# Altium schematic sheet 01_MainSheet.SchDoc
size A4; Organization: OLTEST; Revision: 01; SheetNumber: 1; SheetTotal: 13; Название листа: Название листа; Разработчик: Бондарчук С.; Прибор: R100; АМАК.000000.000 Э3: R100.230.030.000-00; Дата: 16.04.2019; Формат: A4; WorkspaceName: R100_Board_v1; PageSetup: Record=PageOptions|CenterHorizontal=True|CenterVertical=True|PrintScale=0.97|XCorrection=1.00|YCorrection=1.00|PrintKind=0|BorderSize=5000000|LeftOffset=0|BottomOffset=0|Orientation=2|PaperLength=1000|PaperWidth=1000|Scale=100|PaperSource=7|PrintQuality=-3|MediaType=1|DitherType=10|PrintScaleMode=1|PaperKind=A4|PaperIndex=9
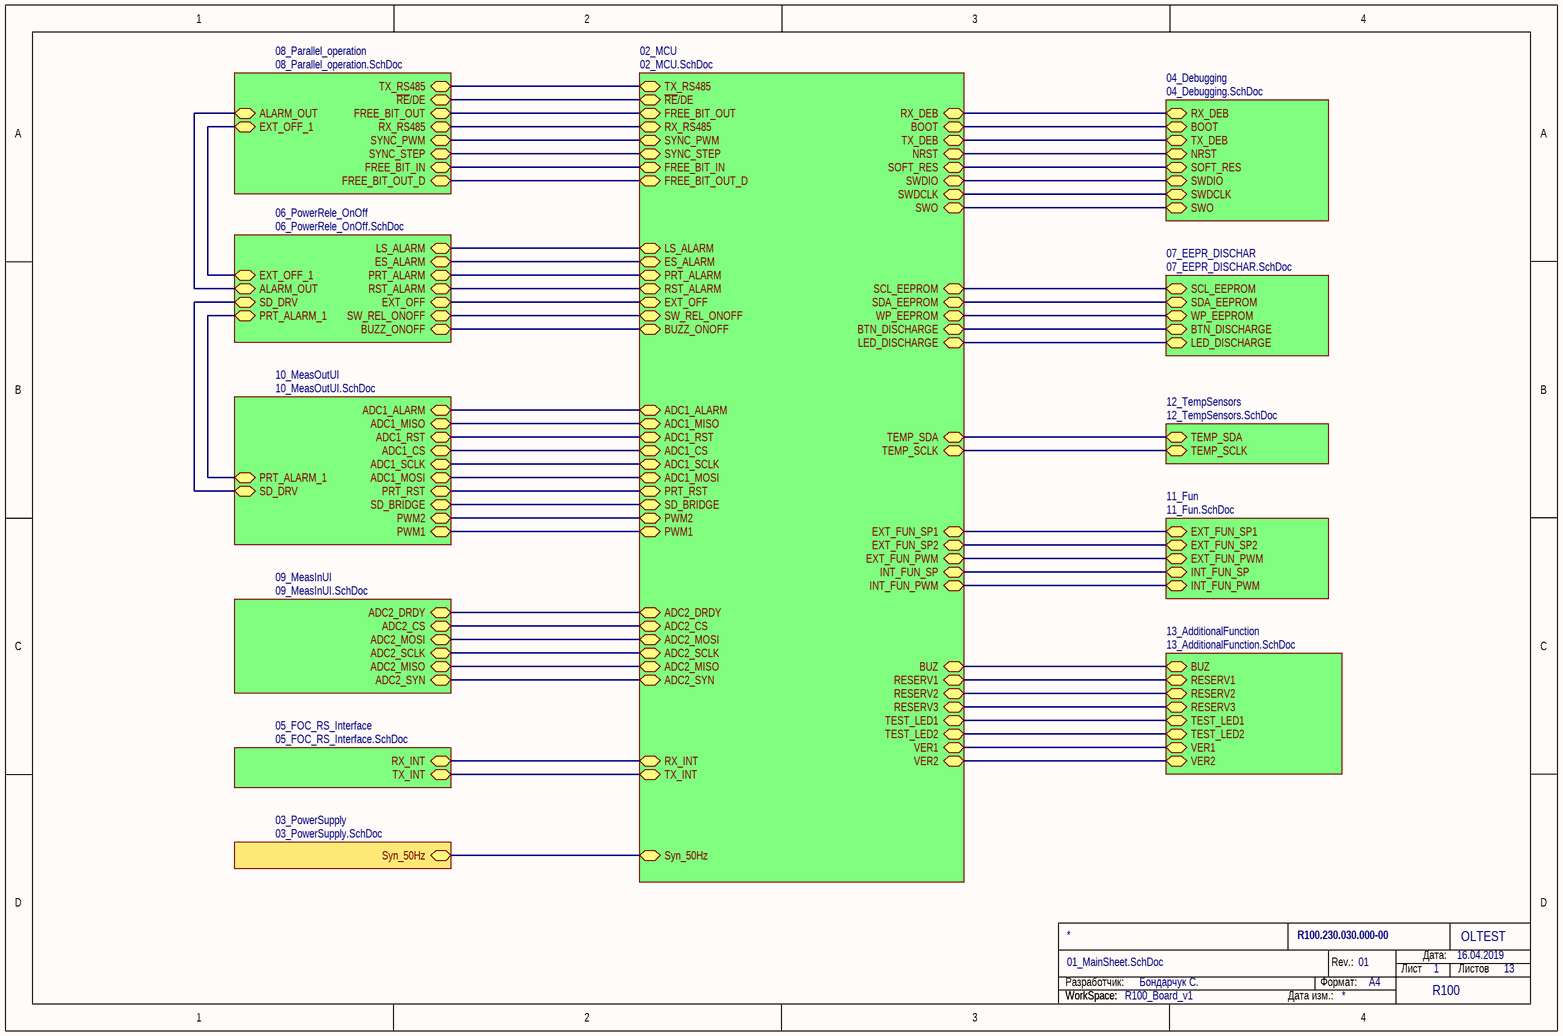
[diagram p0: 01_MainSheet.SchDoc]

## Sub-sheets
02_MCU = 02_MCU.SchDoc: SWO, SOFT_RES, TX_INT, PRT_ALARM, WP_EEPROM, SWDCLK, TX_RS485, LS_ALARM, SCL_EEPROM, SW_REL_ONOFF, ES_ALARM, NRST, RST_ALARM, RX_INT, RX_DEB, Syn_50Hz, BOOT, SDA_EEPROM, SWDIO, TX_DEB, SYNC_PWM, INT_FUN_SP, ADC1_MISO, TEMP_SDA, VER2, LED_DISCHARGE, RX_RS485, ADC1_MOSI, ADC2_MOSI, EXT_FUN_SP2, ADC1_ALARM, FREE_BIT_IN, VER1, ADC2_CS, TEST_LED2, BUZ, ADC1_RST, ADC2_SYN, SD_BRIDGE, ADC1_SCLK, TEST_LED1, PWM1, BUZZ_ONOFF, ADC2_SCLK, EXT_FUN_SP1, ADC1_CS, BTN_DISCHARGE, RESERV2, EXT_OFF, PWM2, ADC2_MISO, RESERV1, EXT_FUN_PWM, TEMP_SCLK, PRT_RST, RESERV3, FREE_BIT_OUT, ~{RE}/DE, INT_FUN_PWM, ADC2_DRDY, SYNC_STEP, FREE_BIT_OUT_D
03_PowerSupply = 03_PowerSupply.SchDoc: Syn_50Hz
04_Debugging = 04_Debugging.SchDoc: SWDIO, TX_DEB, RX_DEB, SWO, SWDCLK, BOOT, SOFT_RES, NRST
05_FOC_RS_Interface = 05_FOC_RS_Interface.SchDoc: RX_INT, TX_INT
06_PowerRele_OnOff = 06_PowerRele_OnOff.SchDoc: PRT_ALARM_1, LS_ALARM, ES_ALARM, PRT_ALARM, RST_ALARM, SW_REL_ONOFF, ALARM_OUT, BUZZ_ONOFF, EXT_OFF, SD_DRV, EXT_OFF_1
07_EEPR_DISCHAR = 07_EEPR_DISCHAR.SchDoc: SCL_EEPROM, SDA_EEPROM, WP_EEPROM, BTN_DISCHARGE, LED_DISCHARGE
08_Parallel_operation = 08_Parallel_operation.SchDoc: ~{RE}/DE, FREE_BIT_OUT, TX_RS485, ALARM_OUT, RX_RS485, SYNC_PWM, SYNC_STEP, FREE_BIT_IN, EXT_OFF_1, FREE_BIT_OUT_D
09_MeasInUI = 09_MeasInUI.SchDoc: ADC2_CS, ADC2_MOSI, ADC2_DRDY, ADC2_SCLK, ADC2_MISO, ADC2_SYN
10_MeasOutUI = 10_MeasOutUI.SchDoc: SD_BRIDGE, ADC1_RST, ADC1_ALARM, PRT_RST, ADC1_MISO, PRT_ALARM_1, ADC1_SCLK, ADC1_CS, ADC1_MOSI, PWM2, PWM1, SD_DRV
11_Fun = 11_Fun.SchDoc: EXT_FUN_PWM, EXT_FUN_SP1, EXT_FUN_SP2, INT_FUN_SP, INT_FUN_PWM
12_TempSensors = 12_TempSensors.SchDoc: TEMP_SCLK, TEMP_SDA
13_AdditionalFunction = 13_AdditionalFunction.SchDoc: RESERV3, RESERV2, VER2, BUZ, RESERV1, VER1, TEST_LED1, TEST_LED2

## Nets
(unnamed): sheet 02_MCU/SWO, sheet 04_Debugging/SWO
(unnamed): sheet 02_MCU/SOFT_RES, sheet 04_Debugging/SOFT_RES
(unnamed): sheet 02_MCU/TX_INT, sheet 05_FOC_RS_Interface/TX_INT
(unnamed): sheet 02_MCU/PRT_ALARM, sheet 06_PowerRele_OnOff/PRT_ALARM
(unnamed): sheet 02_MCU/WP_EEPROM, sheet 07_EEPR_DISCHAR/WP_EEPROM
(unnamed): sheet 02_MCU/SWDCLK, sheet 04_Debugging/SWDCLK
(unnamed): sheet 02_MCU/TX_RS485, sheet 08_Parallel_operation/TX_RS485
(unnamed): sheet 02_MCU/LS_ALARM, sheet 06_PowerRele_OnOff/LS_ALARM
(unnamed): sheet 02_MCU/SCL_EEPROM, sheet 07_EEPR_DISCHAR/SCL_EEPROM
(unnamed): sheet 02_MCU/SW_REL_ONOFF, sheet 06_PowerRele_OnOff/SW_REL_ONOFF
(unnamed): sheet 02_MCU/ES_ALARM, sheet 06_PowerRele_OnOff/ES_ALARM
(unnamed): sheet 02_MCU/NRST, sheet 04_Debugging/NRST
(unnamed): sheet 02_MCU/RST_ALARM, sheet 06_PowerRele_OnOff/RST_ALARM
(unnamed): sheet 02_MCU/RX_INT, sheet 05_FOC_RS_Interface/RX_INT
(unnamed): sheet 02_MCU/RX_DEB, sheet 04_Debugging/RX_DEB
(unnamed): sheet 02_MCU/Syn_50Hz, sheet 03_PowerSupply/Syn_50Hz
(unnamed): sheet 02_MCU/BOOT, sheet 04_Debugging/BOOT
(unnamed): sheet 02_MCU/SDA_EEPROM, sheet 07_EEPR_DISCHAR/SDA_EEPROM
(unnamed): sheet 02_MCU/SWDIO, sheet 04_Debugging/SWDIO
(unnamed): sheet 02_MCU/TX_DEB, sheet 04_Debugging/TX_DEB
(unnamed): sheet 02_MCU/SYNC_PWM, sheet 08_Parallel_operation/SYNC_PWM
(unnamed): sheet 02_MCU/INT_FUN_SP, sheet 11_Fun/INT_FUN_SP
(unnamed): sheet 02_MCU/ADC1_MISO, sheet 10_MeasOutUI/ADC1_MISO
(unnamed): sheet 02_MCU/TEMP_SDA, sheet 12_TempSensors/TEMP_SDA
(unnamed): sheet 02_MCU/VER2, sheet 13_AdditionalFunction/VER2
(unnamed): sheet 02_MCU/LED_DISCHARGE, sheet 07_EEPR_DISCHAR/LED_DISCHARGE
(unnamed): sheet 02_MCU/RX_RS485, sheet 08_Parallel_operation/RX_RS485
(unnamed): sheet 02_MCU/ADC1_MOSI, sheet 10_MeasOutUI/ADC1_MOSI
(unnamed): sheet 02_MCU/ADC2_MOSI, sheet 09_MeasInUI/ADC2_MOSI
(unnamed): sheet 02_MCU/EXT_FUN_SP2, sheet 11_Fun/EXT_FUN_SP2
(unnamed): sheet 02_MCU/ADC1_ALARM, sheet 10_MeasOutUI/ADC1_ALARM
(unnamed): sheet 02_MCU/FREE_BIT_IN, sheet 08_Parallel_operation/FREE_BIT_IN
(unnamed): sheet 02_MCU/VER1, sheet 13_AdditionalFunction/VER1
(unnamed): sheet 02_MCU/ADC2_CS, sheet 09_MeasInUI/ADC2_CS
(unnamed): sheet 02_MCU/TEST_LED2, sheet 13_AdditionalFunction/TEST_LED2
(unnamed): sheet 02_MCU/BUZ, sheet 13_AdditionalFunction/BUZ
(unnamed): sheet 02_MCU/ADC1_RST, sheet 10_MeasOutUI/ADC1_RST
(unnamed): sheet 02_MCU/ADC2_SYN, sheet 09_MeasInUI/ADC2_SYN
(unnamed): sheet 02_MCU/SD_BRIDGE, sheet 10_MeasOutUI/SD_BRIDGE
(unnamed): sheet 02_MCU/ADC1_SCLK, sheet 10_MeasOutUI/ADC1_SCLK
(unnamed): sheet 02_MCU/TEST_LED1, sheet 13_AdditionalFunction/TEST_LED1
(unnamed): sheet 02_MCU/PWM1, sheet 10_MeasOutUI/PWM1
(unnamed): sheet 02_MCU/BUZZ_ONOFF, sheet 06_PowerRele_OnOff/BUZZ_ONOFF
(unnamed): sheet 02_MCU/ADC2_SCLK, sheet 09_MeasInUI/ADC2_SCLK
(unnamed): sheet 02_MCU/EXT_FUN_SP1, sheet 11_Fun/EXT_FUN_SP1
(unnamed): sheet 02_MCU/ADC1_CS, sheet 10_MeasOutUI/ADC1_CS
(unnamed): sheet 02_MCU/BTN_DISCHARGE, sheet 07_EEPR_DISCHAR/BTN_DISCHARGE
(unnamed): sheet 02_MCU/RESERV2, sheet 13_AdditionalFunction/RESERV2
(unnamed): sheet 02_MCU/EXT_OFF, sheet 06_PowerRele_OnOff/EXT_OFF
(unnamed): sheet 02_MCU/PWM2, sheet 10_MeasOutUI/PWM2
(unnamed): sheet 02_MCU/ADC2_MISO, sheet 09_MeasInUI/ADC2_MISO
(unnamed): sheet 02_MCU/RESERV1, sheet 13_AdditionalFunction/RESERV1
(unnamed): sheet 02_MCU/EXT_FUN_PWM, sheet 11_Fun/EXT_FUN_PWM
(unnamed): sheet 02_MCU/TEMP_SCLK, sheet 12_TempSensors/TEMP_SCLK
(unnamed): sheet 02_MCU/PRT_RST, sheet 10_MeasOutUI/PRT_RST
(unnamed): sheet 02_MCU/RESERV3, sheet 13_AdditionalFunction/RESERV3
(unnamed): sheet 02_MCU/FREE_BIT_OUT, sheet 08_Parallel_operation/FREE_BIT_OUT
(unnamed): sheet 02_MCU/~{RE}/DE, sheet 08_Parallel_operation/~{RE}/DE
(unnamed): sheet 02_MCU/INT_FUN_PWM, sheet 11_Fun/INT_FUN_PWM
(unnamed): sheet 02_MCU/ADC2_DRDY, sheet 09_MeasInUI/ADC2_DRDY
(unnamed): sheet 02_MCU/SYNC_STEP, sheet 08_Parallel_operation/SYNC_STEP
(unnamed): sheet 02_MCU/FREE_BIT_OUT_D, sheet 08_Parallel_operation/FREE_BIT_OUT_D
(unnamed): sheet 06_PowerRele_OnOff/PRT_ALARM_1, sheet 10_MeasOutUI/PRT_ALARM_1
(unnamed): sheet 06_PowerRele_OnOff/ALARM_OUT, sheet 08_Parallel_operation/ALARM_OUT
(unnamed): sheet 06_PowerRele_OnOff/SD_DRV, sheet 10_MeasOutUI/SD_DRV
(unnamed): sheet 06_PowerRele_OnOff/EXT_OFF_1, sheet 08_Parallel_operation/EXT_OFF_1

## Notes on the sheet
- Разработчик:
- Формат:
- Rev.:
- Лист
- Дата:
- Листов
- WorkSpace:
- Дата изм.: